# EAGLE design nano-SO2R (EAGLE 9.2.2)
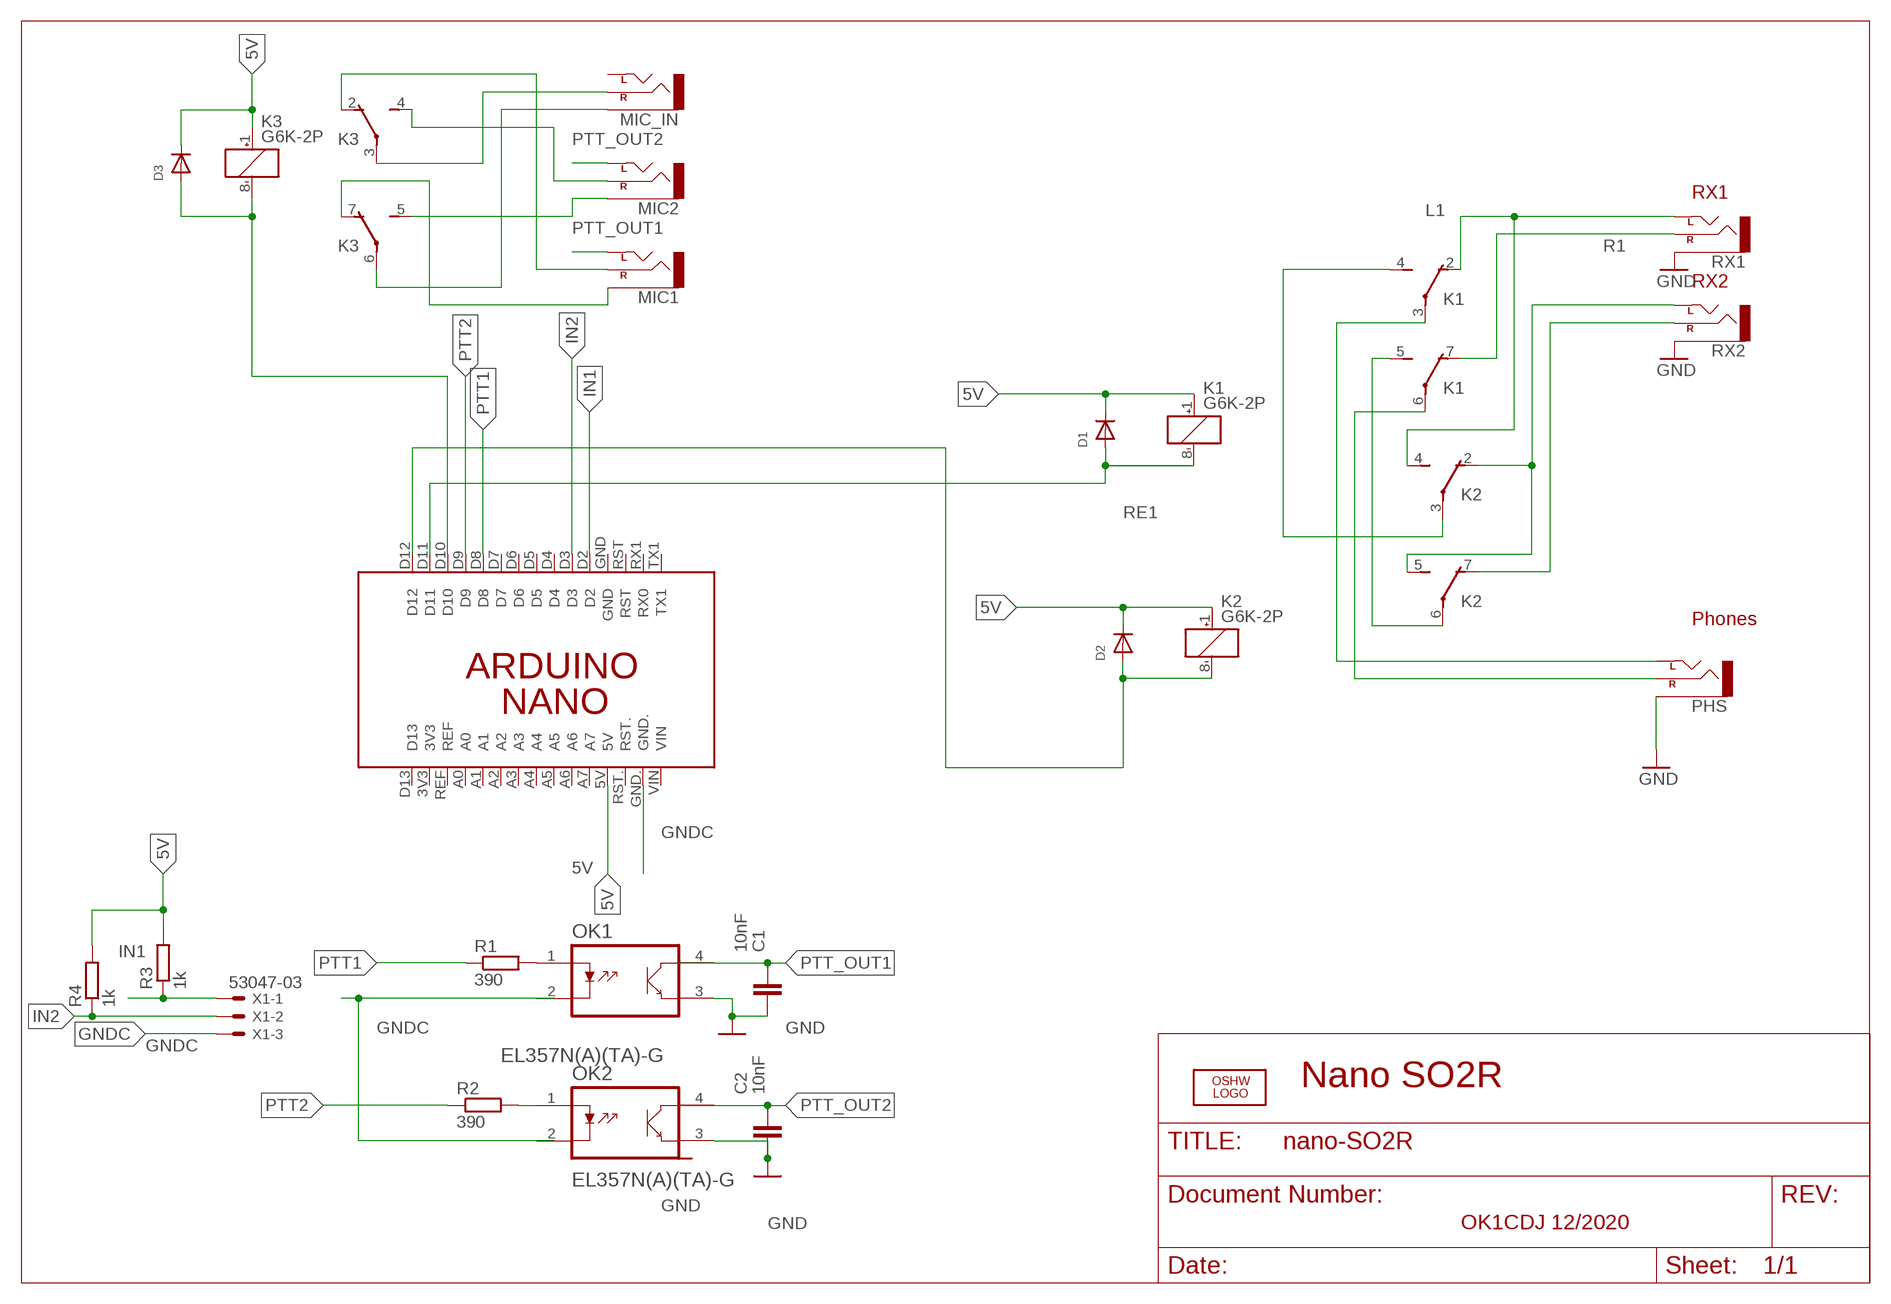
[diagram p0: schematic, sheet 1]

## Parts
C1  10nF  C-EUC0805  [C0805]
C2  10nF  C-EUC0805  [C0805]
D1  DIODESOD-323F  [SOD-323F]
D2  DIODESOD-323F  [SOD-323F]
D3  DIODESOD-323F  [SOD-323F]
K1  G6K-2P  [G6K-2P]
K2  G6K-2P  [G6K-2P]
K3  G6K-2P  [G6K-2P]
LOGO1  OSHW_LOGO_FILLX0150-NT  [OSHW_FILLX150_NOTEXT]
MIC1  MIC1  AUDIO-JACKPTH  [AUDIO-JACK]
MIC2  AUDIO-JACKPTH  [AUDIO-JACK]
MIC_IN  AUDIO-JACKPTH  [AUDIO-JACK]
OK1  EL357N(A)(TA)-G  [SOP254P700X200-4N]
OK2  EL357N(A)(TA)-G  [SOP254P700X200-4N]
PCB1  ARDUINO_NANO  [ARDUINO_NANO]
PHS  AUDIO-JACKPTH  [AUDIO-JACK]
R1  390  R-EU_M0805  [M0805]
R2  390  R-EU_M0805  [M0805]
R3  1k  R-EU_M0805  [M0805]
R4  1k  R-EU_M0805  [M0805]
RX1  AUDIO-JACKPTH  [AUDIO-JACK]
RX2  AUDIO-JACKPTH  [AUDIO-JACK]
X1  53047-03  [53047-03]

## Nets
5V: D1.C D2.C D3.C K1.1(1:+) K2.1(1:+) K3.1(1:+) PCB1.5V R3.2 R4.2
GND: C1.2 C2.2 OK1.3(E) OK2.3(E) PHS.SLEEVE RX1.SLEEVE RX2.SLEEVE
GNDC: OK1.2(K) OK2.2(K) PCB1.GND. X1.3
IN1: PCB1.D2 R3.1 X1.1
IN2: PCB1.D3 R4.1 X1.2
L1: K1.2(2:O) K2.4(2:S) RX1.TIP(LEFT)
N$1: D3.A K3.8(1:-) PCB1.D10
N$2: K3.3(2:P) MIC_IN.RING(RIGHT)
N$3: K3.6(3:P) MIC_IN.SLEEVE
N$4: K2.2(2:O) K2.5(3:S) RX2.TIP(LEFT)
N$5: K2.7(3:O) RX2.RING(RIGHT)
N$6: K1.3(2:P) PHS.TIP(LEFT)
N$7: K1.6(3:P) PHS.RING(RIGHT)
N$8: K1.4(2:S) K2.3(2:P)
N$10: K1.5(3:S) K2.6(3:P)
N$11: K3.2(2:O) MIC1.RING(RIGHT)
N$12: OK2.1(A) R2.2
N$13: K3.7(3:O) MIC1.SLEEVE
N$14: K3.5(3:S) MIC2.SLEEVE
N$15: K3.4(2:S) MIC2.RING(RIGHT)
N$16: OK1.1(A) R1.2
PTT1: PCB1.D8 R1.1
PTT2: PCB1.D9 R2.1
PTT_OUT1: C1.1 MIC1.TIP(LEFT) OK1.4(C)
PTT_OUT2: C2.1 MIC2.TIP(LEFT) OK2.4(C)
R1: K1.7(3:O) RX1.RING(RIGHT)
RE1: D1.A K1.8(1:-) PCB1.D11
RE2: D2.A K2.8(1:-) PCB1.D12
Unconnected: MIC_IN.TIP(LEFT) PCB1.3V3 PCB1.A0 PCB1.A1 PCB1.A2 PCB1.A3 PCB1.A4 PCB1.A5 PCB1.A6 PCB1.A7 PCB1.D4 PCB1.D5 PCB1.D6 PCB1.D7 PCB1.D13 PCB1.GND PCB1.REF PCB1.RST PCB1.RST. PCB1.RX1(RX0) PCB1.TX1 PCB1.VIN

## Notes on the sheet
- RX1
- RX2
- Phones
- Nano SO2R
- OK1CDJ 12/2020

## Library data of the parts
C1 C2 = rcl:C-EU: CAPACITOR, European symbol
D1-D3 = adafruit:DIODE: Diode SMADIODE - SMA Surface Mount Package 20V 1A Schottky Diode Digikey: 641-1014-6-ND DO-1N4148 - Through Hole Small Current Diode SOD-123 20V 1 A (.5mV Vf) Schottky Diode - Digikey: MBRX120TPMSCT-ND SOD-323 10V 570mA (.38mV Vf, 3ns) Schottky Diode - Digikey: ZLLS410CT-ND SOD-523 30V 30mA Schottky Diode (RB751S-40TE61) - Digikey: RB751S-40TE61CT-ND SOT23-R/W - SOT23 Package (R = Solder Paste/Reflow Ovens, W = Hand-Soldering) BAT54Film 40V 300mA - Digikey: 497-7162-1-ND
K1-K3 = relay:G6K: Low Signal Relay oeiwcsnts1.omron.com/.. D20G6K0100.pdf; MF: OMRON COMPONENTS USA; MPN: G6K-2P DC3; OC_FARNELL: 3937276; OC_NEWARK: 89C6482
LOGO1 = ohw-logo:OSHW_LOGO_FILL
MIC1 MIC2 MIC_IN PHS RX1 RX2 = SparkFun:AUDIO-JACK: 3.5mm Audio Jack Simple 3.5mm common PCB mount audio jack. SKU: PRT-08032
OK1 OK2 = EL357N_A__TA_-G:EL357N(A)(TA)-G: Optocoupler [Everlight Electronics] EL357N(A)(TA)-G Optocoupler Check prices <https://pricing.snapeda.com/parts/EL357N%28A%29%28TA%29-G/Everlight%20Electronics/view-part?ref=eda>; AVAILABILITY: Bad; DESCRIPTION: Optoisolator Transistor Output 3750Vrms 1 Channel 4-SOP (2.54mm); MF: Everlight Electronics; MP: EL357N(A)(TA)-G; PACKAGE: SOP-4 Everlight; PRICE: None
PCB1 = E14_Arduino_published:ARDUINO_NANO: Device for representing an Arduino Nano board with a footprint in an EAGLE design. Created by Dave Young for Element14. More EAGLE documentation at: http://www.element14.com/community/community/knode/cadsoft_eagle
R1-R4 = rcl:R-EU_: RESISTOR, European symbol
X1 = con-molex:53?-03: CONNECTOR wire to board 1.25 mm (.049 inch) pitch header; MPN: 530470310; OC_FARNELL: 9732853; OC_NEWARK: 14R5412

## Board
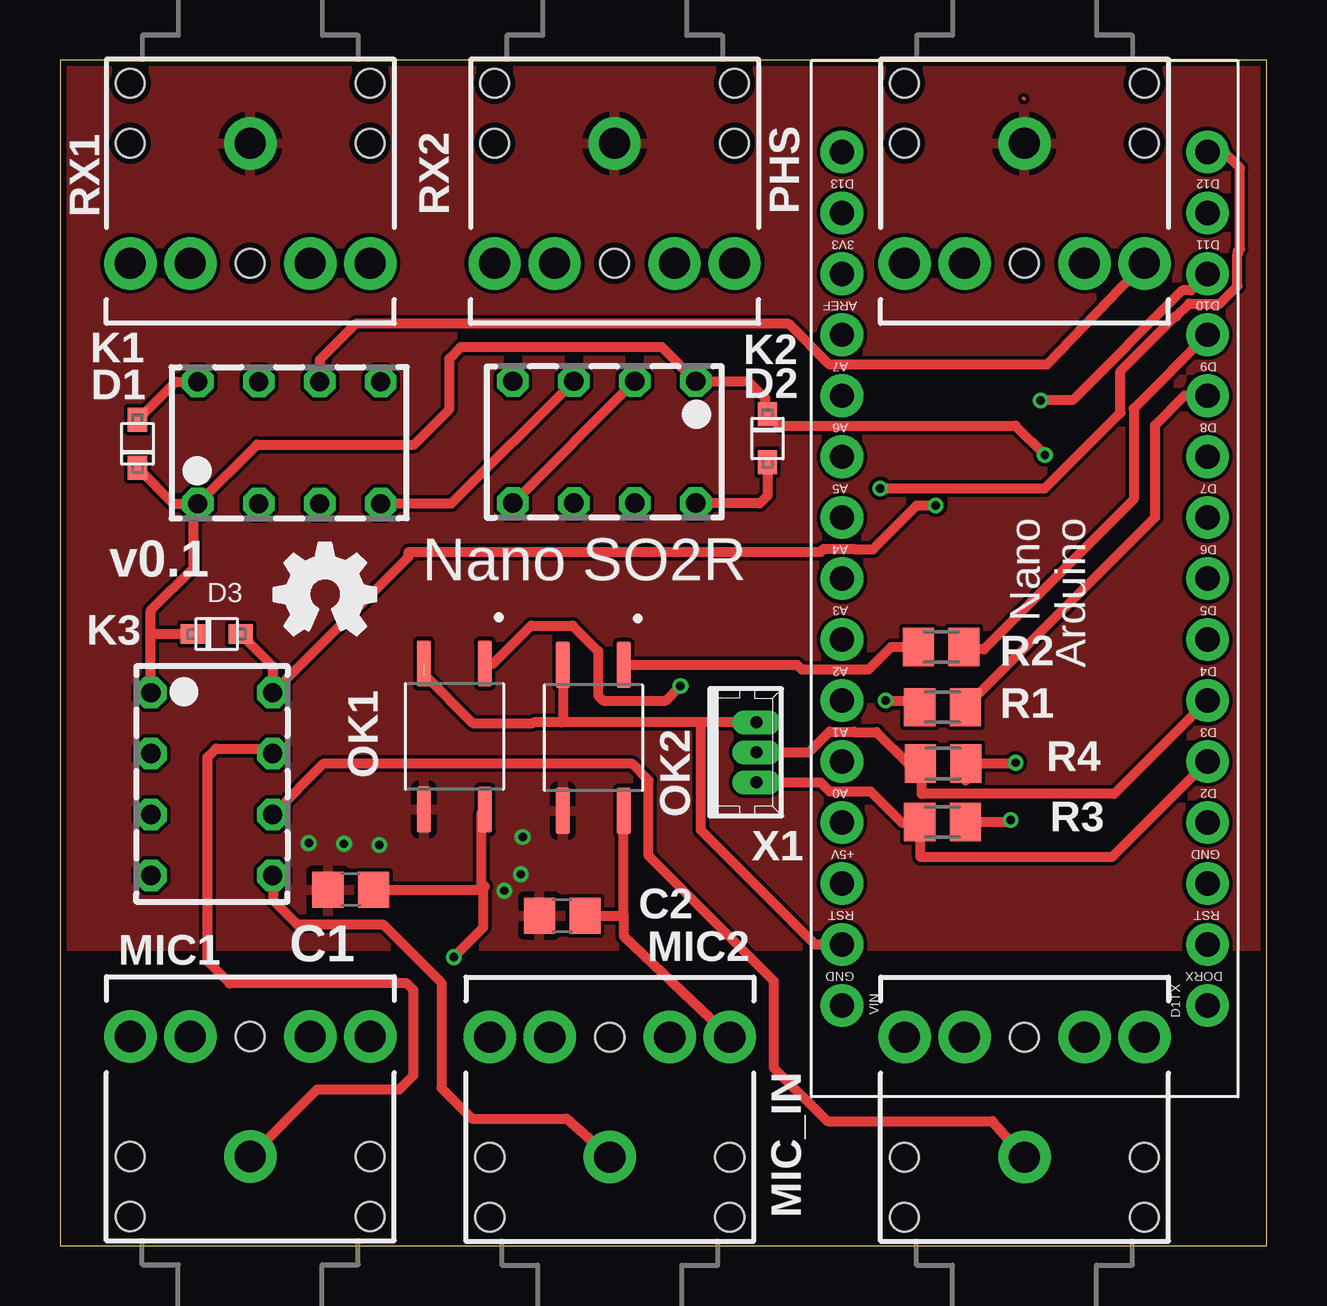
[diagram p1: board, top side]
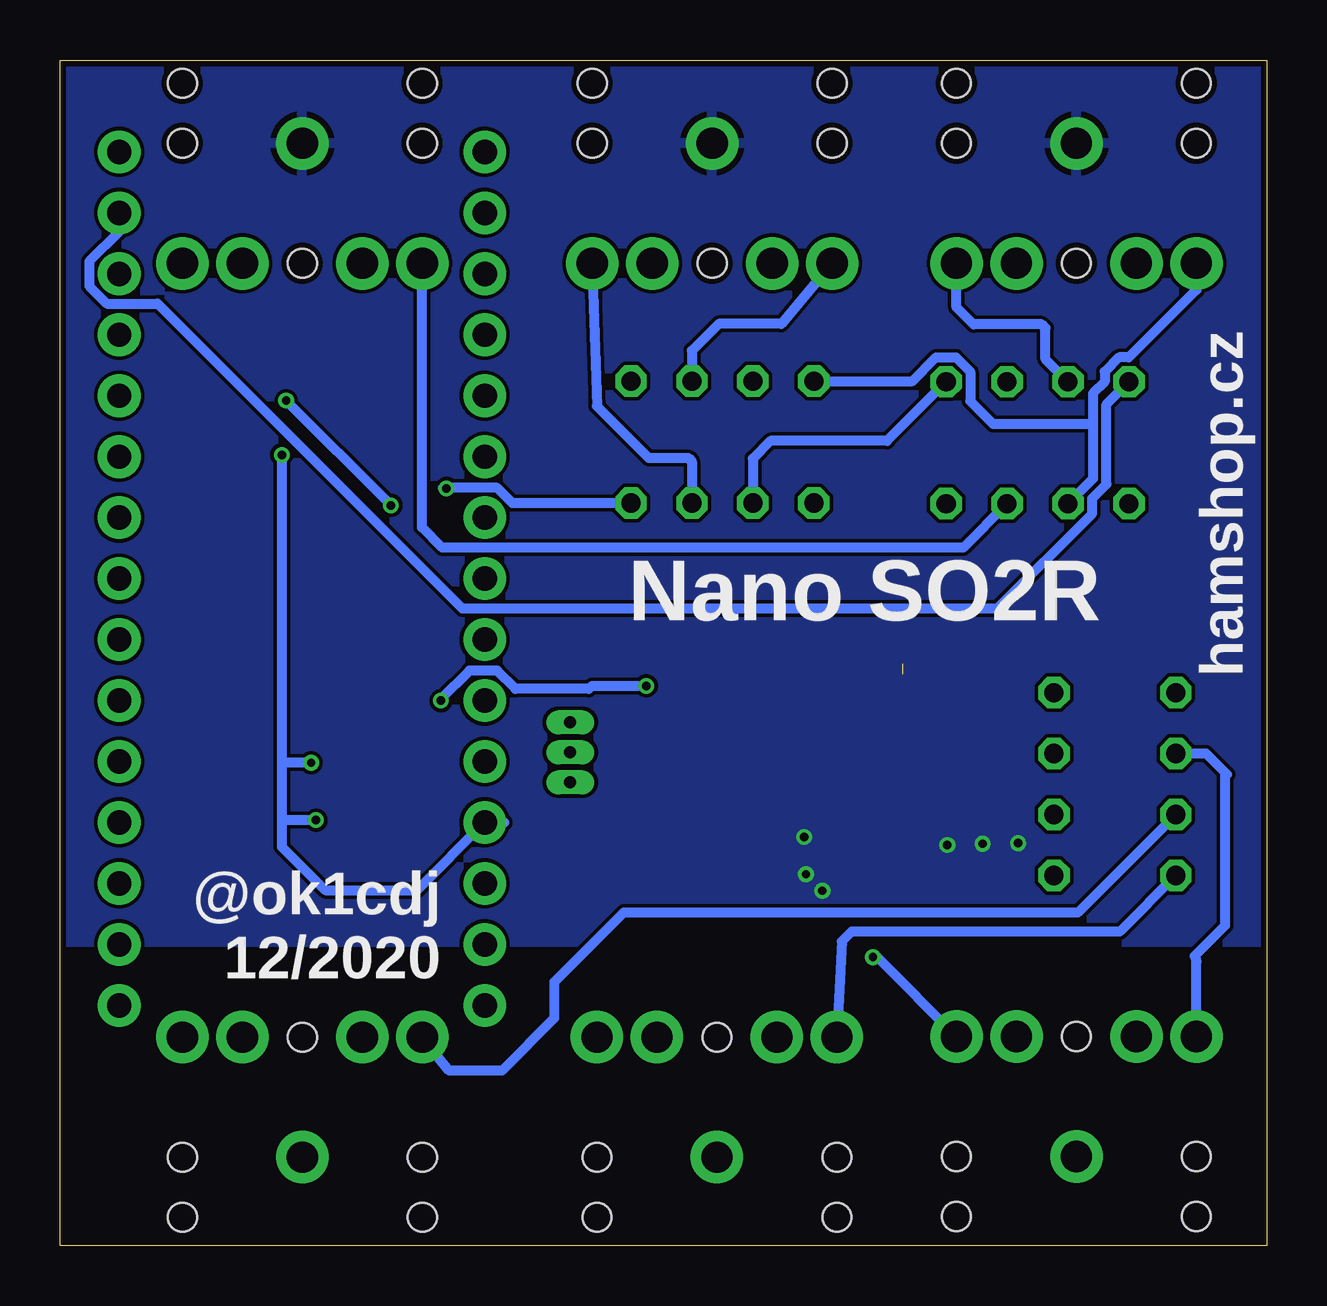
[diagram p2: board, bottom side, seen from below]

Size 50.3 x 49.4 mm. Coordinates in mm from the lower left corner, seen from the top.
Outline: 0,0 50.3,0 50.3,49.4 0,49.4 0,0
Copper layers (1*16): Top 0.035mm / dielectric 1.5mm / Bottom 0.035mm
Design rules "Fusion_eagle_rule_v1.1": minimum track width 6mil, minimum drill 12mil, track to track 6mil, track to pad 6mil, pad to pad 6mil, via to via 6mil, smd to smd 0mil, copper to edge 10mil, drill to drill 10mil, minimum pad ring 10mil, minimum via ring 6mil, stop-mask expansion 2mil, vias tented up to drill 100mil, thermal gap 10mil

### Footprints (pad centres in the part's own frame; a part is rotated, then mirrored left to right if it is on the bottom)
C0805 = smd 1.3 x 1.5: 1 -0.95,0; 2 0.95,0
SOD-323F = smd 1 x 0.8: A -1,0; C 1,0
G6K-2P = drill 0.8 octagon: 1 -2.54,-2.54; 2 0,-2.54; 3 2.54,-2.54; 4 5.08,-2.54; 5 5.08,2.54; 6 2.54,2.54; 7 0,2.54; 8 -2.54,2.54
AUDIO-JACK = drill 1.3 pad 2.184: RING 5,5; RSH 5,2.5; SLEEVE 0,0; TIP 5,-5; TSH 5,-2.5 | hole 1.2: 0,5; -2.5,5; -2.5,-5; 0,-5; 5,0
SOP254P700X200-4N = smd 1.93 x 0.59: 1 -3.04,1.27; 2 -3.04,-1.27; 3 3.04,-1.27; 4 3.04,1.27
ARDUINO_NANO = drill 1.016 pad 1.778: 3V3 6.35,1.27; 5V 31.75,1.27; A0 11.43,1.27; A1 13.97,1.27; A2 16.51,1.27; A3 19.05,1.27; A4 21.59,1.27; A5 24.13,1.27; A6 26.67,1.27; A7 29.21,1.27; D2 29.21,16.51; D3 26.67,16.51; D4 24.13,16.51; D5 21.59,16.51; D6 19.05,16.51; D7 16.51,16.51; D8 13.97,16.51; D9 11.43,16.51; D10 8.89,16.51; D11 6.35,16.51; D12 3.81,16.51; D13 3.81,1.27; GND 31.75,16.51; GND. 36.83,1.27; REF 8.89,1.27; RST 34.29,16.51; RST. 34.29,1.27; RX1 36.83,16.51; TX1 39.37,16.51; VIN 39.37,1.27
M0805 = smd 1.3 x 1.6: 1 -0.95,0; 2 0.95,0
53047-03 = drill 0.5 pad 0.698 long: 1 1.25,0.45; 2 0,0.45; 3 -1.25,0.45

### Placement (x,y rotation side)
C1  12.12,14.84 180 top
C2  20.93,13.74 180 top
D1  3.23,33.4 270 top
D2  29.49,33.63 90 top
D3  6.53,25.48 180 top
K1  8.29,33.45 0 top
K2  23.96,33.48 180 top
K3  6.33,20.5 270 top
LOGO1  8.92,25.45 0 top
MIC1  7.93,3.71 90 top
MIC2  22.92,3.69 90 top
MIC_IN  40.2,3.69 90 top
OK1  16.44,21.21 270 top
OK2  22.23,21.16 270 top
PCB1  31.32,49.38 270 top
PHS  40.2,45.93 270 top
R1  36.78,22.43 180 top
R2  36.73,24.95 180 top
R3  36.78,17.66 0 top
R4  36.81,20.09 0 top
RX1  7.93,45.93 270 top
RX2  23.12,45.93 270 top
X1  28.58,20.55 270 top

### Tracks (layer width: path | path; a pad name or v marks a point on that pad's centre or on a via)
5V  (via drill 0.35)
  Top 0.406: D1.C 4.72,30.91 5.57,30.91 | 5.57,30.91 K1.1 8.21,33.38 14.76,33.38 16.23,34.85 16.23,36.96 16.72,37.44 25.07,37.44 K2.1 28.68,36.02 29.39,35.31 29.39,34.73 D2.C 29.96,34.17 39.83,34.17 v41.05,32.95 | K3.1 3.79,25.4 | 3.79,25.4 3.79,26.47 5.57,28.25 5.57,30.91 | D3.C 3.87,25.48 3.79,25.4 | 37.76,19.38 R4.2 39.81,20.1 v39.83,20.12 | R3.2 39.63,17.66 39.65,17.68 39.63,17.71 v39.63,17.73
  Bottom 0.406: 31.78,17.63 PCB1.5V 35.41,14.81 39.25,14.81 41.05,16.62 41.05,17.68 | v41.05,32.95 41.05,20.07 | 41.05,20.07 41.05,17.68 | v39.83,20.12 41,20.12 41.05,20.07 | v39.63,17.73 41,17.73 41.05,17.68
GND  (via drill 0.35)
  other vias: 19.28,17.02 10.37,16.77 11.84,16.74 13.31,16.69 19.21,15.47 18.52,14.79
  pour Top: -0.02,12.5 50.2,12.5 50.2,49.41 -0.02,49.41
  pour Bottom: -0.02,49.3 50.2,49.3 50.2,12.65 -0.02,12.65
GNDC  (1 unrouted)
  Top 0.406: PCB1.GND. 31.47,12.55 26.7,17.33 26.7,21.8 | 15.17,23.8 17.2,21.77 19.71,21.77 19.75,21.8 20.91,21.8 | X1.3 26.7,21.8 | 26.7,21.8 20.91,21.8 | OK2.2 20.96,21.85 20.91,21.8
IN1
  Top 0.406: PCB1.D2 43.85,16.18 35.87,16.18 35.87,17.62 | 35.87,17.62 R3.1 | X1.1 31.7,19.3 32.08,18.93 33.79,18.93 35.09,17.62 35.87,17.62
IN2
  Top 0.406: PCB1.D3 43.95,18.82 35.92,18.82 35.92,20.03 R4.1 35.34,20.1 34.04,21.39 33.13,21.39 33.11,21.41 32.08,21.41 31.21,20.55 X1.2
L1
  Bottom 0.406: RX1.TIP 2.93,39.83 5.75,37 6.16,37 6.75,36.41 6.75,36 7.24,35.51 7.24,34.27 | 7.24,34.27 7.24,31.96 K1.2 | K2.4 14.77,36.02 13.78,37 12.95,37 12.36,36.41 12.36,35.19 11.41,34.24 7.27,34.24 7.24,34.27
N$1  (via drill 0.35)
  Top 0.406: D3.A 8.87,24.14 K3.8 14.53,28.71 14.53,28.91 31.7,28.91 31.83,29.04 33.11,29.04 33.13,29.01 33.89,29.01 35.72,30.84 v36.51,30.84 | PCB1.D10 47.15,39.8 46.79,39.8 42.22,35.23 40.9,35.23 v40.87,35.21
  Bottom 0.406: v40.87,35.21 36.63,30.97 36.63,30.84 v36.51,30.84
N$2
  Bottom 0.406: K3.3 7.88,13.87 22.2,13.87 26.8,13.87 29.7,10.98 29.7,9.48 31.88,7.29 34.07,7.29 MIC_IN.RING
N$3
  Top 0.406: MIC_IN.SLEEVE 38.87,5.18 31.98,5.18 29.75,7.42 29.75,11.03 24.54,16.23 24.54,19.38 23.86,20.07 10.98,20.07 K3.6
N$4
  Top 0.406: K2.2 K2.5
  Bottom 0.406: RX2.TIP 20.23,38.41 22.84,38.41 23.96,37.29 K2.2
N$5
  Bottom 0.406: RX2.RING 27.92,34.97 25.76,32.82 24.11,32.82 23.96,32.67 K2.7
N$6
  Bottom 0.406: K1.3 12.65,29.09 34.37,29.09 35.21,29.93 PHS.TIP
N$7
  Top 0.406: PHS.RING 41.15,36.71 32.08,36.71 30.38,38.41 12.32,38.41 10.82,36.91 K1.6
N$8
  Top 0.406: K2.3 16.31,30.91 K1.4
N$9
  Top 0.152: 40.16,47.81 40.19,47.78
N$10
  Bottom 0.406: K1.5 15.83,33.53 20.68,33.53 21.42,32.79 K2.6
N$11
  Bottom 0.406: MIC1.RING 2.93,11.81 3,12.07 1.73,13.34 1.73,19.56 1.66,19.64 2.52,20.5 K3.2
N$12
  Top 0.406: OK2.1 30.72,24.2 30.92,24.01 33.71,24.01 34.65,24.95 R2.2
N$13
  Top 0.406: MIC1.SLEEVE 10.72,6.51 14.15,6.51 14.74,7.09 14.74,10.65 14.46,10.93 7.07,10.93 6.15,11.84 6.15,20.35 6.51,20.7 8.67,20.7 K3.7
N$14
  Top 0.406: K3.5 8.89,15.42 8.89,14.38 9.88,13.39 13.47,13.39 15.9,10.95 15.9,6.56 17.18,5.29 21.11,5.29 MIC2.SLEEVE
N$15
  Bottom 0.406: K3.4 6.13,13.08 17.3,13.08 17.71,12.67 MIC2.RING
N$16  (via drill 0.35)
  Top 0.406: OK1.1 18.06,24.25 19.64,25.84 21.37,25.84 22.43,24.77 22.43,22.91 22.64,22.71 25.25,22.71 v25.86,23.32 | v34.42,22.71 35.55,22.71 R1.2
  Bottom 0.406: v25.86,23.32 28.12,23.32 28.25,23.19 31.31,23.19 32.08,23.96 33.23,23.96 34.45,22.74 v34.42,22.71
PTT1
  Top 0.406: R1.1 45.65,30.35 45.65,34.19 46.87,35.41 PCB1.D8
PTT2
  Top 0.406: PCB1.D9 44.76,34.88 44.76,31.09 38.51,24.84 37.79,24.84 R2.1
PTT_OUT1  (via drill 0.35)
  Top 0.406: 17.71,14.96 17.63,14.89 | 17.63,14.89 17.63,13.24 v16.41,12.02 | C1.1 17.58,14.84 | 17.58,14.84 17.63,14.89 | 17.58,14.84 17.58,18.05 OK1.4
  Bottom 0.406: v16.41,12.02 16.23,12.02 MIC1.TIP
PTT_OUT2
  Top 0.406: 23.5,13.75 23.5,12.9 MIC2.TIP | C2.1 23.5,13.75 | 23.5,13.75 OK2.4
R1
  Bottom 0.406: K1.7 9.22,36.93 9.22,38.23 9.38,38.38 12.22,38.38 12.93,39.09 RX1.RING
RE1
  Top 0.406: D1.A 4.82,35.99 K1.8
  Bottom 0.406: PCB1.D11 47.83,42.25 49.08,41.01 49.08,39.97 48.35,39.25 46.23,39.25 33.53,26.55 11.23,26.55 7.28,30.5 7.28,31.13 6.69,31.73 6.69,35.05 K1.8
RE2  (via drill 0.35)
  Top 0.406: PCB1.D12 48.52,45.57 49.18,44.91 49.18,41.53 49.1,41.46 49.1,41.33 49.08,41.3 49.08,39.97 48.35,39.25 47.07,39.25 46.54,38.71 46.49,38.71 44.2,36.43 44.2,34.7 41.05,31.55 v34.19,31.55 | D2.A 29.49,31.25 29.16,30.91 29.14,30.94 K2.8
  Bottom 0.406: K2.8 31.44,30.94 32.08,31.57 34.22,31.57 | 34.35,31.57 34.22,31.57 | 34.22,31.57 v34.19,31.55

### Text on the board
tNames: v0.1 | Nano SO2R
bNames: hamshop.cz | Nano SO2R | @ok1cdj / 12/2020